# Altium project MLB_REV1.PrjPcb (part 3 of 3)

## Sheet VELOSTAT_SENSING.SchDoc: =DocumentName
size B; SheetNumber: 6; SheetTotal: 8
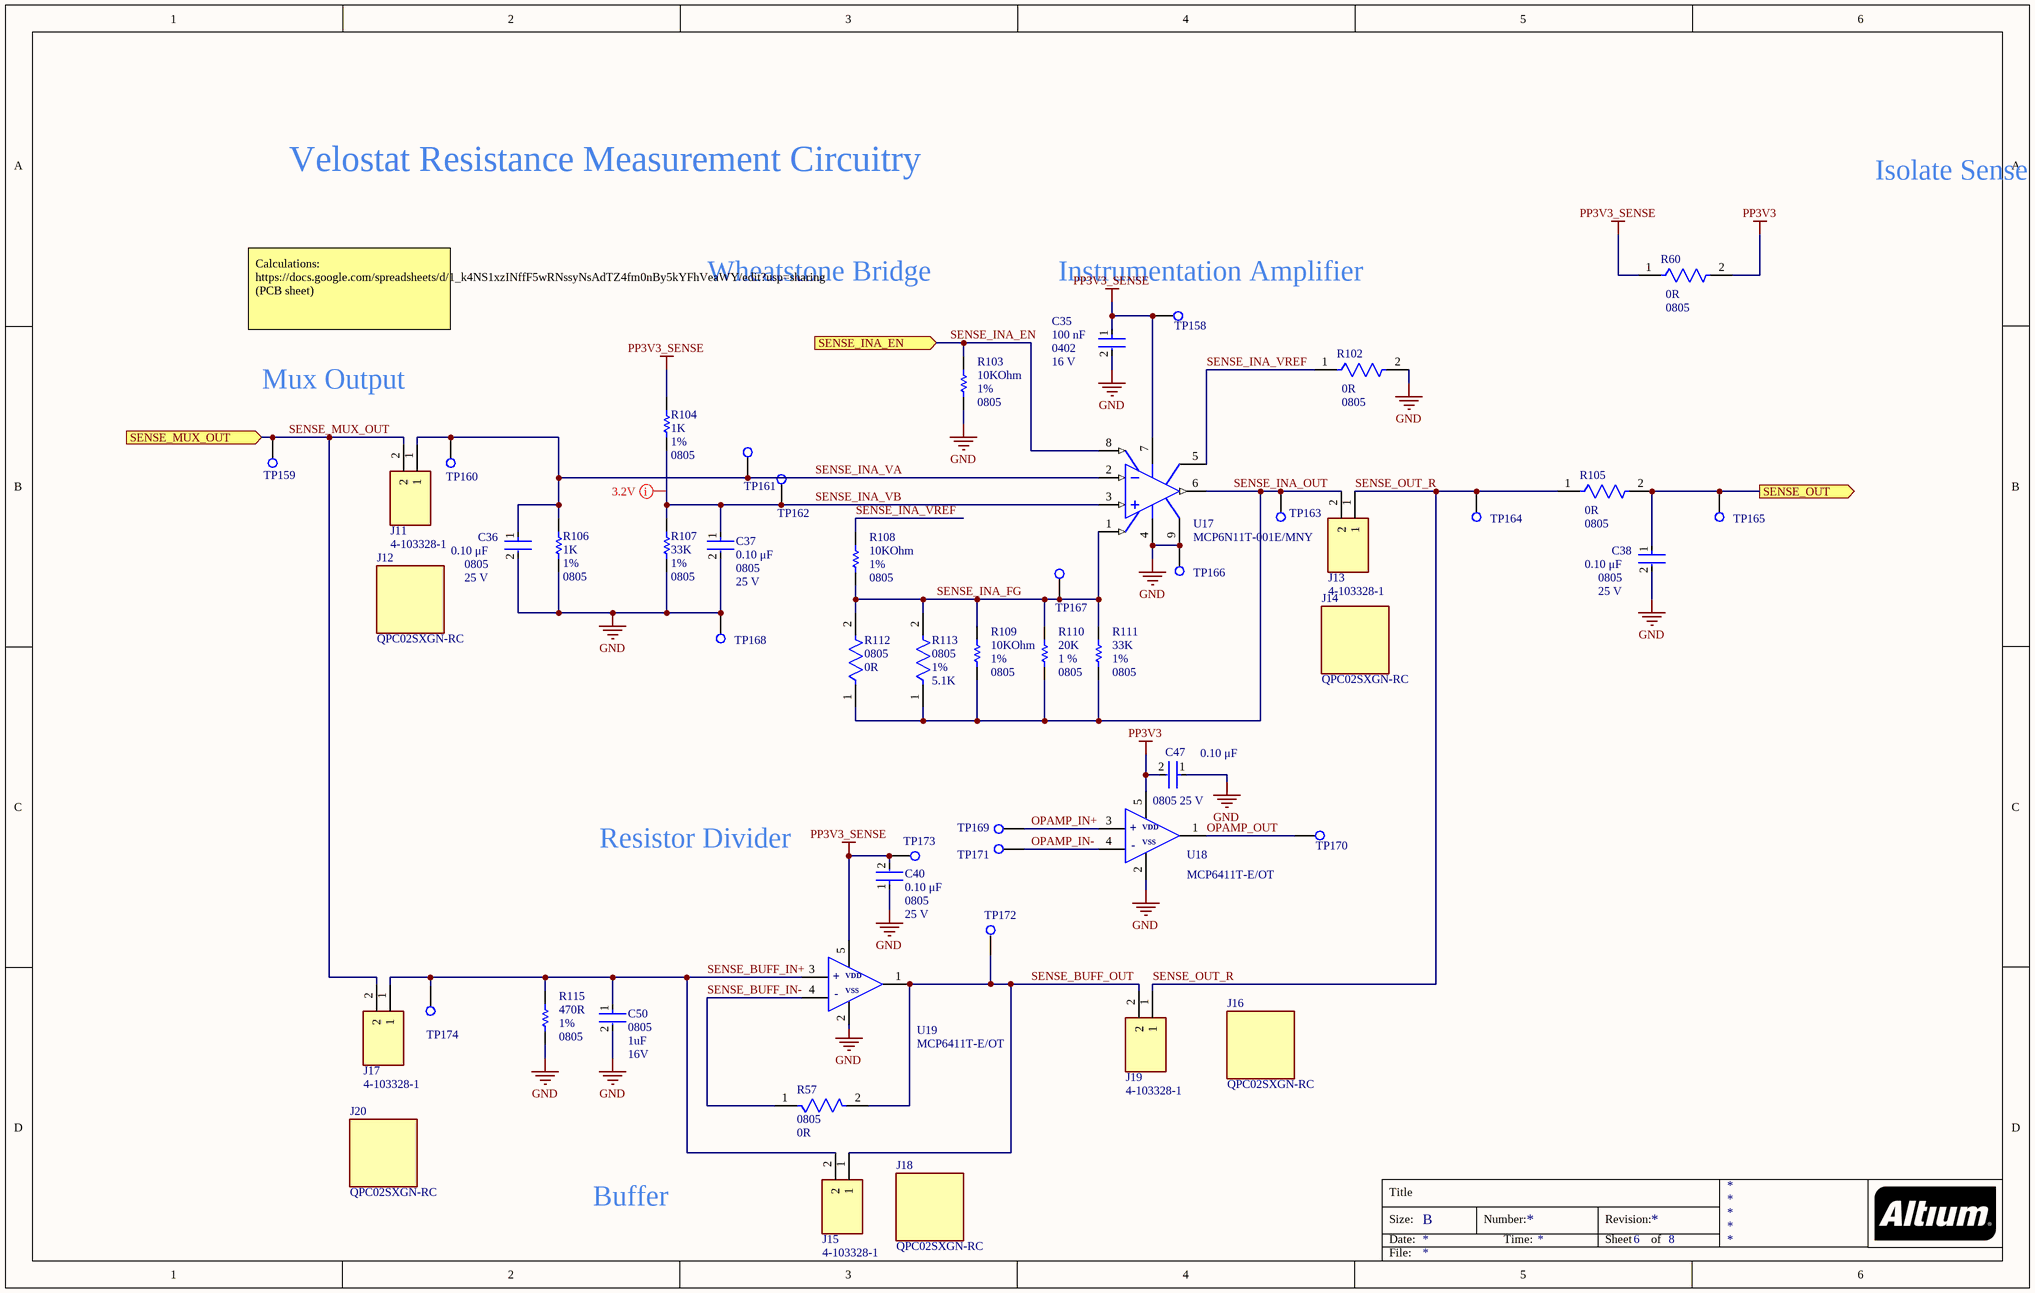
[diagram p5: VELOSTAT_SENSING.SchDoc]

### Parts
(Parts that share a designator on the sheet are numbered #1, #2 ... from top to bottom, then left to right.)
C35#2  Package: 0402  Voltage Rating: 16 V  Capacitance: 100 nF  [FP-CC0402-IPC_B]  (hidden comment: CC0402KRX7R7BB104)
C36#2  Capacitance: 0.10 μF  Package: 0805  Voltage Rating: 25 V  [FP-C0805C-DN-IPC_B]  (hidden comment: C0805C104M3RACTU)
C37#2  Capacitance: 0.10 μF  Package: 0805  Voltage Rating: 25 V  [FP-C0805C-DN-IPC_B]  (hidden comment: C0805C104M3RACTU)
C38#2  Capacitance: 0.10 μF  Package: 0805  Voltage Rating: 25 V  [FP-C0805C-DN-IPC_B]  (hidden comment: C0805C104M3RACTU)
C40  Capacitance: 0.10 μF  Package: 0805  Voltage Rating: 25 V  [FP-C0805C-DN-IPC_B]  (hidden comment: C0805C104M3RACTU)
C47#1  Capacitance: 0.10 μF  Package: 0805  Voltage Rating: 25 V  [FP-C0805C-DN-IPC_B]  (hidden comment: C0805C104M3RACTU)
C50#1  Case/Package: 0805  Capacitance: 1uF  Voltage: 16V  [FP-CL21-IPC_A]  (hidden comment: CL21B105KOFNNNE)
J11#2  4-103328-1  [TE_4-103328-1]
J12#2  QPC02SXGN-RC  [FP-QPC02SXGN-RC-MFG]
J13  4-103328-1  [TE_4-103328-1]
J14  QPC02SXGN-RC  [FP-QPC02SXGN-RC-MFG]
J15  4-103328-1  [TE_4-103328-1]
J16  QPC02SXGN-RC  [FP-QPC02SXGN-RC-MFG]
J17  4-103328-1  [TE_4-103328-1]
J18  QPC02SXGN-RC  [FP-QPC02SXGN-RC-MFG]
J19  4-103328-1  [TE_4-103328-1]
J20  QPC02SXGN-RC  [FP-QPC02SXGN-RC-MFG]
R57#2  Case/Package: 0805  Resistance: 0R  [FP-RMCF0805-MFG]  (hidden comment: RMCF0805ZT0R00)
R60#2  Case/Package: 0805  Resistance: 0R  [FP-RMCF0805-MFG]  (hidden comment: RMCF0805ZT0R00)
R102  Case/Package: 0805  Resistance: 0R  [FP-RMCF0805-MFG]  (hidden comment: RMCF0805ZT0R00)
R103  value 10KOhm  PackageReference: 0805  Tolerance: 1%  [RESC2013X60X35NL10T20]  (hidden comment: RC0805FR-0710KL)
R104  Resistance: 1K  Tolerance: 1%  Case Code (Imperial): 0805  [RESC2013X60X35ML10T20]  (hidden comment: RC0805FR-071KL)
R105  Case/Package: 0805  Resistance: 0R  [FP-RMCF0805-MFG]  (hidden comment: RMCF0805ZT0R00)
R106  Resistance: 1K  Tolerance: 1%  Case Code (Imperial): 0805  [RESC2013X60X35ML10T20]  (hidden comment: RC0805FR-071KL)
R107  value 33K  Tolerance: 1%  Package: 0805  [RESC2013X70X40LL20T20]  (hidden comment: ERJ-6GEYJ333V)
R108  value 10KOhm  PackageReference: 0805  Tolerance: 1%  [RESC2013X60X35NL10T20]  (hidden comment: RC0805FR-0710KL)
R109  value 10KOhm  PackageReference: 0805  Tolerance: 1%  [RESC2013X60X35NL10T20]  (hidden comment: RC0805FR-0710KL)
R110  value 20K  Tolerance: 1 %  Case-EIA: 0805  [RESC0805(2012)_N]  (hidden comment: 20K 1% 0805(2012))
R111  value 33K  Tolerance: 1%  Package: 0805  [RESC2013X70X40LL20T20]  (hidden comment: ERJ-6GEYJ333V)
R112  Case/Package: 0805  Resistance: 0R  [FP-RMCF0805-MFG]  (hidden comment: RMCF0805ZT0R00)
R113  Case Code (Imperial): 0805  Tolerance: 1%  Resistance: 5.1K  [FP-CRCW0805-e3-MFG]  (hidden comment: CRCW08055K10FKEA)
R115  Package Reference: 0805  Resistance Tolerance: 1%  Resistance: 470R  [RESC2013X60X35ML10T20]  (hidden comment: RC0805FR-07470RL)
TP158  RCU-0C  [TP+195X110]  (value not drawn)
TP159  RCU-0C  [TP+195X110]  (value not drawn)
TP160  RCU-0C  [TP+195X110]  (value not drawn)
TP161  RCU-0C  [TP+195X110]  (value not drawn)
TP162  RCU-0C  [TP+195X110]  (value not drawn)
TP163  RCU-0C  [TP+195X110]  (value not drawn)
TP164  RCU-0C  [TP+195X110]  (value not drawn)
TP165  RCU-0C  [TP+195X110]  (value not drawn)
TP166  RCU-0C  [TP+195X110]  (value not drawn)
TP167  RCU-0C  [TP+195X110]  (value not drawn)
TP168  RCU-0C  [TP+195X110]  (value not drawn)
TP169  RCU-0C  [TP+195X110]  (value not drawn)
TP170  RCU-0C  [TP+195X110]  (value not drawn)
TP171  RCU-0C  [TP+195X110]  (value not drawn)
TP172  RCU-0C  [TP+195X110]  (value not drawn)
TP173  RCU-0C  [TP+195X110]  (value not drawn)
TP174  RCU-0C  [TP+195X110]  (value not drawn)
U17  MCP6N11T-001E/MNY  [TDFN-MN8]
U18  MCP6411T-E/OT  [SOT95P280X145-5N]
U19  MCP6411T-E/OT  [SOT95P280X145-5N]

### Ports
SENSE_INA_EN (in), SENSE_MUX_OUT (in), SENSE_OUT (out)

### Nets
GND: C35#2.2 C36#2.2 C37#2.2 C38#2.2 C40.1 C47#1.1 C50#1.2 R102.2 R103.1 R106.1 R107.1 R115.1 TP166.1 TP168.1 U17.4(VSS) U17.9(EP) U18.2(VSS) U19.2(VSS)
PP3V3: C47#1.2 R60#2.2 U18.5(VDD)
PP3V3_SENSE: C35#2.1 C40.2 R60#2.1 R104.2 TP158.1 TP173.1 U17.7(VDD) U19.5(VDD)
OPAMP_IN+: TP169.1 U18.3(VIN+)
OPAMP_IN-: TP171.1 U18.4(VIN-)
OPAMP_OUT: TP170.1 U18.1(VOUT)
SENSE_BUFF_IN+: C50#1.1 J15.2 J17.1 R115.2 TP174.1 U19.3(VIN+)
SENSE_BUFF_IN-: R57#2.1 U19.4(VIN-)
SENSE_BUFF_OUT: J15.1 J19.2 R57#2.2 TP172.1 U19.1(VOUT)
SENSE_INA_EN: R103.2 U17.8(EN/~{CAL}) ; port SENSE_INA_EN
SENSE_INA_FG: R108.1 R109.2 R110.2 R111.2 R112.2 R113.2 TP167.1 U17.1(VFG)
SENSE_INA_OUT: J13.2 R109.1 R110.1 R111.1 R112.1 R113.1 TP163.1 U17.6(VOUT)
SENSE_INA_VA: C36#2.1 J11#2.1 R106.2 TP160.1 TP161.1 U17.2(VIM)
SENSE_INA_VB: C37#2.1 R104.1 R107.2 TP162.1 U17.3(VIP)
SENSE_INA_VREF: R102.1 R108.2 U17.5(VREF)
SENSE_MUX_OUT: J11#2.2 J17.2 TP159.1 ; port SENSE_MUX_OUT
SENSE_OUT: C38#2.1 R105.2 TP165.1 ; port SENSE_OUT
SENSE_OUT_R: J13.1 J19.1 R105.1 TP164.1

### Layout directives
mark named 3.2V: SENSE_INA_VB

### Notes on the sheet
- Velostat Resistance Measurement Circuitry
- Isolate Sense Rail from 3V3 Rail
- Wheatstone Bridge
- Instrumentation Amplifier
- Calculations: https://docs.google.com/spreadsheets/d/1_k4NS1xzINffF5wRNssyNsAdTZ4fm0nBy5kYFhVeaWY/edit?usp=sharing (PCB sheet)
- Mux Output
- Resistor Divider
- Buffer
- Title
- Size:
- Date:
- B
- Number:
- Time:
- Revision:
- Sheet
- of
- File:
- (in symbol MCP6411T-E_OT) +; -

### Library data of the parts
C35#2 = CMP-03422-000048-1: CAP CER 0.1UF 16V X7R 0402; Manufacturer: YAGEO; Material: Ceramic; Automotive Grade: NA; Temperature Coefficient: 30ppm/°C; Tolerance: 0.1; Value: 100 nF; Device Class L1: Passive Components; Temperature Range Low: -55°C; Device Class L3: Ceramic Capacitors; Temperature Characteristic: X7R; Ipc Land Pattern Name: CAPC10050X50; Temperature Range High: +125°C; Temperature: -55°C to +125°C; RoHS: TRUE; Automotive: No; Height: 0.55mm; Device Class L2: Capacitors; Digikey Description: CAP CER 0.1UF 16V X7R 0402; Footprint Url: http://www.yageo.com/exep/pages/download/literatures/UPY-C_GEN_24.pdf; ComponentLink2Description: Datasheet; Category: Cap; Lead Free: Yes; Octopart: https://octopart.com/cc0402krx7r7bb104-yageo-42244624; ComponentLink2URL: http://www.yageo.com/documents/recent/UPY-GP_NP0_16V-to-50V_16.pdf; Manufacturer Part Number: CC0402KRX7R7BB104; Mouser Description: 0402 0.1 uF 16 V ±10 % Tolerance X7R SMT Multilayer Ceramic Capacitor; Supplier: Digi-Key; Supplier Part Number: 311-1338-1-ND
C36#2 C37#2 C38#2 C40 C47#1 = CMP-2007-00282-2: CAP CER 0.1UF 25V 20% X7R 0805; Manufacturer: KEMET; Temperature Coefficient: 30ppm/°C; Material: Ceramic; Tolerance: 0.2; Value: 0.10 μF; Digikey Description: CAP CER 0.1UF 25V 20% X7R 0805; Device Class L2: Capacitors; Temperature: -55°C to +125°C; Device Class L1: Passive Components; ComponentLink2Description: Datasheet; Mouser Description: Multilayer Ceramic Capacitors MLCC - SMD/SMT 25volts 0.1uF X7R 20%; Temperature Range High: +125°C; Device Class L3: Ceramic Capacitors; Automotive: No; Temperature Range Low: -55°C; RoHS: TRUE; Category: Cap; Lead Free: Yes; Ipc Land Pattern Name: CAPC200125X78; Height: 0.88mm; Temperature Characteristic: X7R; Octopart: https://octopart.com/c0805c104m3ractu-kemet-9138612; ComponentLink2URL: https://content.kemet.com/datasheets/KEM_C1003_C0G_SMD.pdf; Manufacturer Part Number: C0805C104M3RACTU; Supplier: Digi-Key; Supplier Part Number: 399-C0805C104M3RAC7800CT-ND
C50#1 = CMP-13271-003098-1: CL21 Series 0805 1uF 16V ±10% Tolerance X7R Multilayer Ceramic Chip Capacitor; Manufacturer: Samsung Electro-Mechanics; Width: 0.049inch; Thickness: 0.053inch; Voltage Rating: 16V; Max Operating Temperature: 125°C; Case Code (Imperial): 0805; Height: 1.25mm; Length: 2mm; Lead Free: Lead Free; Mount: Surface Mount; Tolerance: 10%; Voltage Rating (DC): 16V; Min Operating Temperature: -55°C; Contact Plating: Tin; Depth: 1.25mm; Packaging: Tape and Reel; Package Quantity: 1; Dielectric: X7R; Radiation Hardening: No; Case Code (Metric): 2012; Manufacturer Part Number: CL21B105KOFNNNE; Supplier: Digi-Key; Supplier Part Number: 1276-1026-1-ND
J11#2 J13 J15 J17 J19 = 4-103328-1: Connector Header Through Hole 2 position; Manufacturer: TE Connectivity AMP Connectors; MF: TE Connectivity; SnapEDA_Link: https://www.snapeda.com/parts/4-103328-1/TE%20Connectivity%20AMP%20Connectors/view-part/2384420/?ref=snap; MP: 4-103328-1; TE_purchase_URL: https://www.te.com/usa-en/product-4-103328-1.html?te_bu=Cor&te_type=disp&te_campaign=seda_glo_cor-seda-global-disp-prtnr-fy19-seda-model-bom-cta_sma-317_1&elqCampaignId=32493; Availability: Unavailable; Value: *; EU_RoHS_Compliance: Compliant; Price: None; Package: None; Supplier: Digi-Key; Supplier Part Number: A121364-ND; Manufacturer Part Number: 4-103328-1
J12#2 J14 J16 J18 J20 = CMP-25666-000001-1: CONN JUMPER SHORTING .100" GOLD; Manufacturer: Sullins; Conn Orientation: Straight; Pitch: 2.54mm; Current Rating: 3A; Number Of Contacts: 2; Category: Conn; Temperature Range Low: -40°C; Temperature Range High: +85°C; Device Class L1: Connectors; Lead Free: Yes; Manufacturer Part Number: QPC02SXGN-RC; Automotive: No; Height: 6.17mm; ComponentLink2URL: https://s3.amazonaws.com/catalogspreads-pdf/PAGE128-129%20.100%20JUMPER.pdf; Device Class L2: unset; Footprint Url: https://drawings-pdf.s3.amazonaws.com/11510.pdf; Device Class L3: unset; Temperature: -40°C to +85°C; RoHS: TRUE; Digikey Description: CONN JUMPER SHORTING .100" GOLD; Octopart: https://octopart.com/qpc02sxgn-rc-sullins-19878795; Package: 0; ComponentLink2Description: Datasheet; Contact Material: Gold; Supplier: Digi-Key; Supplier Part Number: S9337-ND
R57#2 R60#2 R102 R105 R112 = CMP-26527-000017-1: RES 0 OHM JUMPER 1/8W 0805; Manufacturer: Stackpole Electronics Inc; Power Rating: 125mW; Depth: 1.25mm; Length: 2mm; Military Standard: Not; Width: 0.049inch; Case Code (Imperial): 0805; Number of Terminations: 2; Mount: Surface Mount; Contact Plating: Tin; Height: 0.026inch; Min Operating Temperature: -55°C; Composition: Thick Film; Max Operating Temperature: 155°C; Packaging: Tape and Reel; Features: Automotive AEC-Q200; Max Power Dissipation: 125mW; Radiation Hardening: No; Lead Free: Lead Free; Case Code (Metric): 2012; Supplier: Digi-Key; Supplier Part Number: RMCF0805ZT0R00CT-ND; Manufacturer Part Number: RMCF0805ZT0R00
R103 R108 R109 = CMP-1659-00013-4: Chip Resistor, 10 KOhm, +/- 1%, 0.125 W, -55 to 155 degC, 0805 (2012 Metric), RoHS, Tape and Reel; Manufacturer: Yageo; Voltage Rating: 150 V; Mount: Surface Mount; ComponentLink1Description: Manufacturer URL; ComponentLink2URL: http://www.yageo.com/documents/recent/PYu-RC_Group_51_RoHS_L_04.pdf; Pins: 2; Length: 2 mm; Min Operating Temperature: -55 degC; Height: 0.5 mm; Mounting Technology: Surface Mount; RoHSCompliant: true; REACH SVHC: No SVHC; ComponentLink1URL: http://www.yageo.com/; Max Operating Temperature: 155 degC; DatasheetVersion: Rev. 4, 02/2016; Package Quantity: 5000; Packaging: Tape and Reel; ComponentLink2Description: Datasheet; PackageDescription: 2-Pin Surface Mounted Device, Body 2 x 1.25 mm; Manufacturer Part Number: RC0805FR-0710KL; Supplier: Digi-Key; Supplier Part Number: RC0805FR-0710KL
R104 R106 = CMP-2100-03671-1: Chip Resistor, 1 KOhm, +/- 1%, 125 mW, -55 to 155 degC, 0805 (2012 Metric), RoHS, Tape and Reel; Manufacturer: Yageo; Temperature Coefficient: 100ppm/degreesC; Voltage Rating (DC): 150V; Max Power Dissipation: 125mW; Number of Pins: 2; Number of Terminations: 2; Datasheet URL: http://www.yageo.com/NewPortal/yageodocoutput?fileName=/pdf/R-Chip/PYu-RC_Group_51_RoHS_L_5.pdf; Length: 0.079inch; Package Description: 2-Pin Surface Mounted Device, Body 2 x 1.25 mm; Depth: 1.25mm; Height: 0.024inch; Military Standard: Not; Case/Package: 0805; Package Reference: 0805; RoHSCompliant: true; Lead Free: LeadFree; Packaging: TapeandReel; Package Quantity: 1; Datasheet Version: Rev. 5, 10/2016; Min Operating Temperature: -55degC; Voltage Rating: 150V; Composition: ThickFilm; Power Rating: 125mW; Width: 0.049inch; Case Code (Metric): 2012; Manufacturer URL: http://www.yageo.com/; Max Operating Temperature: 155degC; REACH SVHC: Unknown; Termination: SMD/SMT; Manufacturer Part Number: RC0805FR-071KL; Supplier: Digi-Key; Supplier Part Number: 311-1.00KCRCT-ND
R107 R111 = CMP-2001-00401-1: Manufacturer: Panasonic; Part Number: ERJ-6GEYJ333V; Supplier: Digi-Key; Supplier Part Number: P33KACT-ND; Manufacturer Part Number: ERJ-6GEYJ333V
R110 = CMP-1013-00655-1: 20K 0.125W 1% 0805 (2012 Metric)  SMD; Manufacturer Part Number: RC0805FR-0720KL; Manufacturer: YAGEO; Case-Metric: 2012; Power: 0.125 W; Technology: SMT; Supplier: Digi-Key; Supplier Part Number: 311-20.0KCRCT-ND
R113 = CMP-2001-04024-2: RES Thick Film, 5.1kΩ, 1%, 0.125W, 100ppm/°C, 0805; Manufacturer: Vishay Dale; Manufacturer Part Number: CRCW08055K10FKEAC; Power Rating: 125mW; Voltage Rating (DC): 150V; Packaging: Tape and Reel; Case Code (Metric): 2012; Contact Plating: Tin; Depth: 1.25mm; Width: 0.049inch; Temperature Coefficient: 100ppm/°C; Max Power Dissipation: 125mW; Military Standard: Not; Lead Free: Lead Free; Mount: Surface Mount; Min Operating Temperature: -55°C; Package Quantity: 10; Weight: 0.000194oz; Height: 0.45mm; Number of Terminations: 2; Max Operating Temperature: 155°C; Termination: SMD/SMT; Case/Package: 0805; Composition: Thick Film; Voltage Rating: 150V; Length: 2mm; Features: Automotive AEC-Q200; Radiation Hardening: No; Supplier: Digi-Key; Supplier Part Number: 541-CRCW08055K10FKEACCT-ND
R115 = CMP-2000-06961-1: Chip Resistor, 470 Ohm, +/- 1%, 125 mW, -55 to 155 degC, 0805 (2012 Metric), RoHS, Tape and Reel; Manufacturer: Yageo; Power Rating: 250mW; Resistor Case Style: 0805[2012Metric]; Voltage Rating: 150V; Resistor Element Type: ThickFilm; Temperature Coefficient: ±100ppm/°C; SVHC: ToBeAdvised; Datasheet Version: Rev. 7, 05/2017; Automotive Qualification Standard: -; Mounting Technology: SurfaceMount; Product Range: -; Packaging: Tape&Reel; Package Description: 2-Pin Surface Mounted Device, Body 2 x 1.25 mm; MSL: MSL1-Unlimited; Datasheet URL: http://www.yageo.com/documents/recent/PYu-RC_Group_51_RoHS_L_7.pdf; Manufacturer URL: http://www.yageo.com/; Supplier: Digi-Key; Supplier Part Number: 311-470CRCT-ND; Manufacturer Part Number: RC0805FR-07470RL
TP158-TP174 = RCU-0C: Natural PC Test Point , Plating Surface Mount Mounting Type; Manufacturer: TE Connectivity AMP Connectors; Value: *; Package: SON-6 TE Connectivity AMP Connectors; Purchase-URL: https://pricing.snapeda.com/search/part/RCU-0C/?ref=eda; Supplier Part Number: A106145CT-ND; Check_prices: https://www.snapeda.com/parts/RCU-0C/TE%20Connectivity/view-part/4791537/?ref=eda; Manufacturer Part Number: RCU-0C; SnapEDA_Link: https://www.snapeda.com/parts/RCU-0C/TE%20Connectivity/view-part/4791537/?ref=snap; Supplier: Digi-Key
U17 = CMP-0187-00751-2: None; Manufacturer: Microchip Technology; Supply Current: 800uA; Max Supply Voltage: 5.5V; Number of Circuits: 1; Input Offset Voltage (Vos): 3mV; Number of Elements: 2; Power Supply Rejection Ratio (PSRR): 62dB; Common Mode Rejection Ratio: 70dB; Unity Gain Bandwidth Product: 500kHz; Slew Rate: 9V/µs; Min Supply Voltage: 1.8V; Input Bias Current: 10pA; Height: 0.75mm; Number of Pins: 8; Min Operating Temperature: -40°C; Lead Free: Lead Free; Number of Channels: 1; REACH SVHC: No SVHC; Max Supply Current: 800uA; Gain Bandwidth Product: 500kHz; Bandwidth: 500kHz; RoHS Compliant: Yes; Length: 3mm; Number of Amplifiers: 1; Package Quantity: 3300; Width: 2mm; Mount: Surface Mount; Radiation Hardening: No; Case/Package: SOIC; Input Offset Voltage-Max: 3mV; Max Operating Temperature: 125°C; Packaging: Tape and Reel; Nominal Supply Current: 800uA; Supplier: Digi-Key; Supplier Part Number: MCP6N11T-001E/MNYCT-ND; Manufacturer Part Number: MCP6N11T-001E/MNY
U18 U19 = MCP6411T-E_OT: IC OPAMP GP 1 CIRCUIT SOT23-5; Manufacturer: Microchip; Datasheet Link: http://ww1.microchip.com/downloads/en/DeviceDoc/20005791B.pdf; Height: 1.45mm; Manufacturer Part Number: MCP6411T-E/OT; Mouser Part Number: 579-MCP6411T-E/OT; Mouser Price/Stock: https://www.mouser.com/Search/Refine.aspx?Keyword=579-MCP6411T-E%2FOT; Arrow Part Number: MCP6411T-E/OT; Arrow Price/Stock: https://www.arrow.com/en/products/mcp6411t-eot/microchip-technology; Supplier: Digi-Key; Supplier Part Number: MCP6411T-E/OTCT-ND

## Sheet MAT_CABLING_CONNECTOR.SchDoc: =DocumentName
size B; SheetNumber: 7; SheetTotal: 8
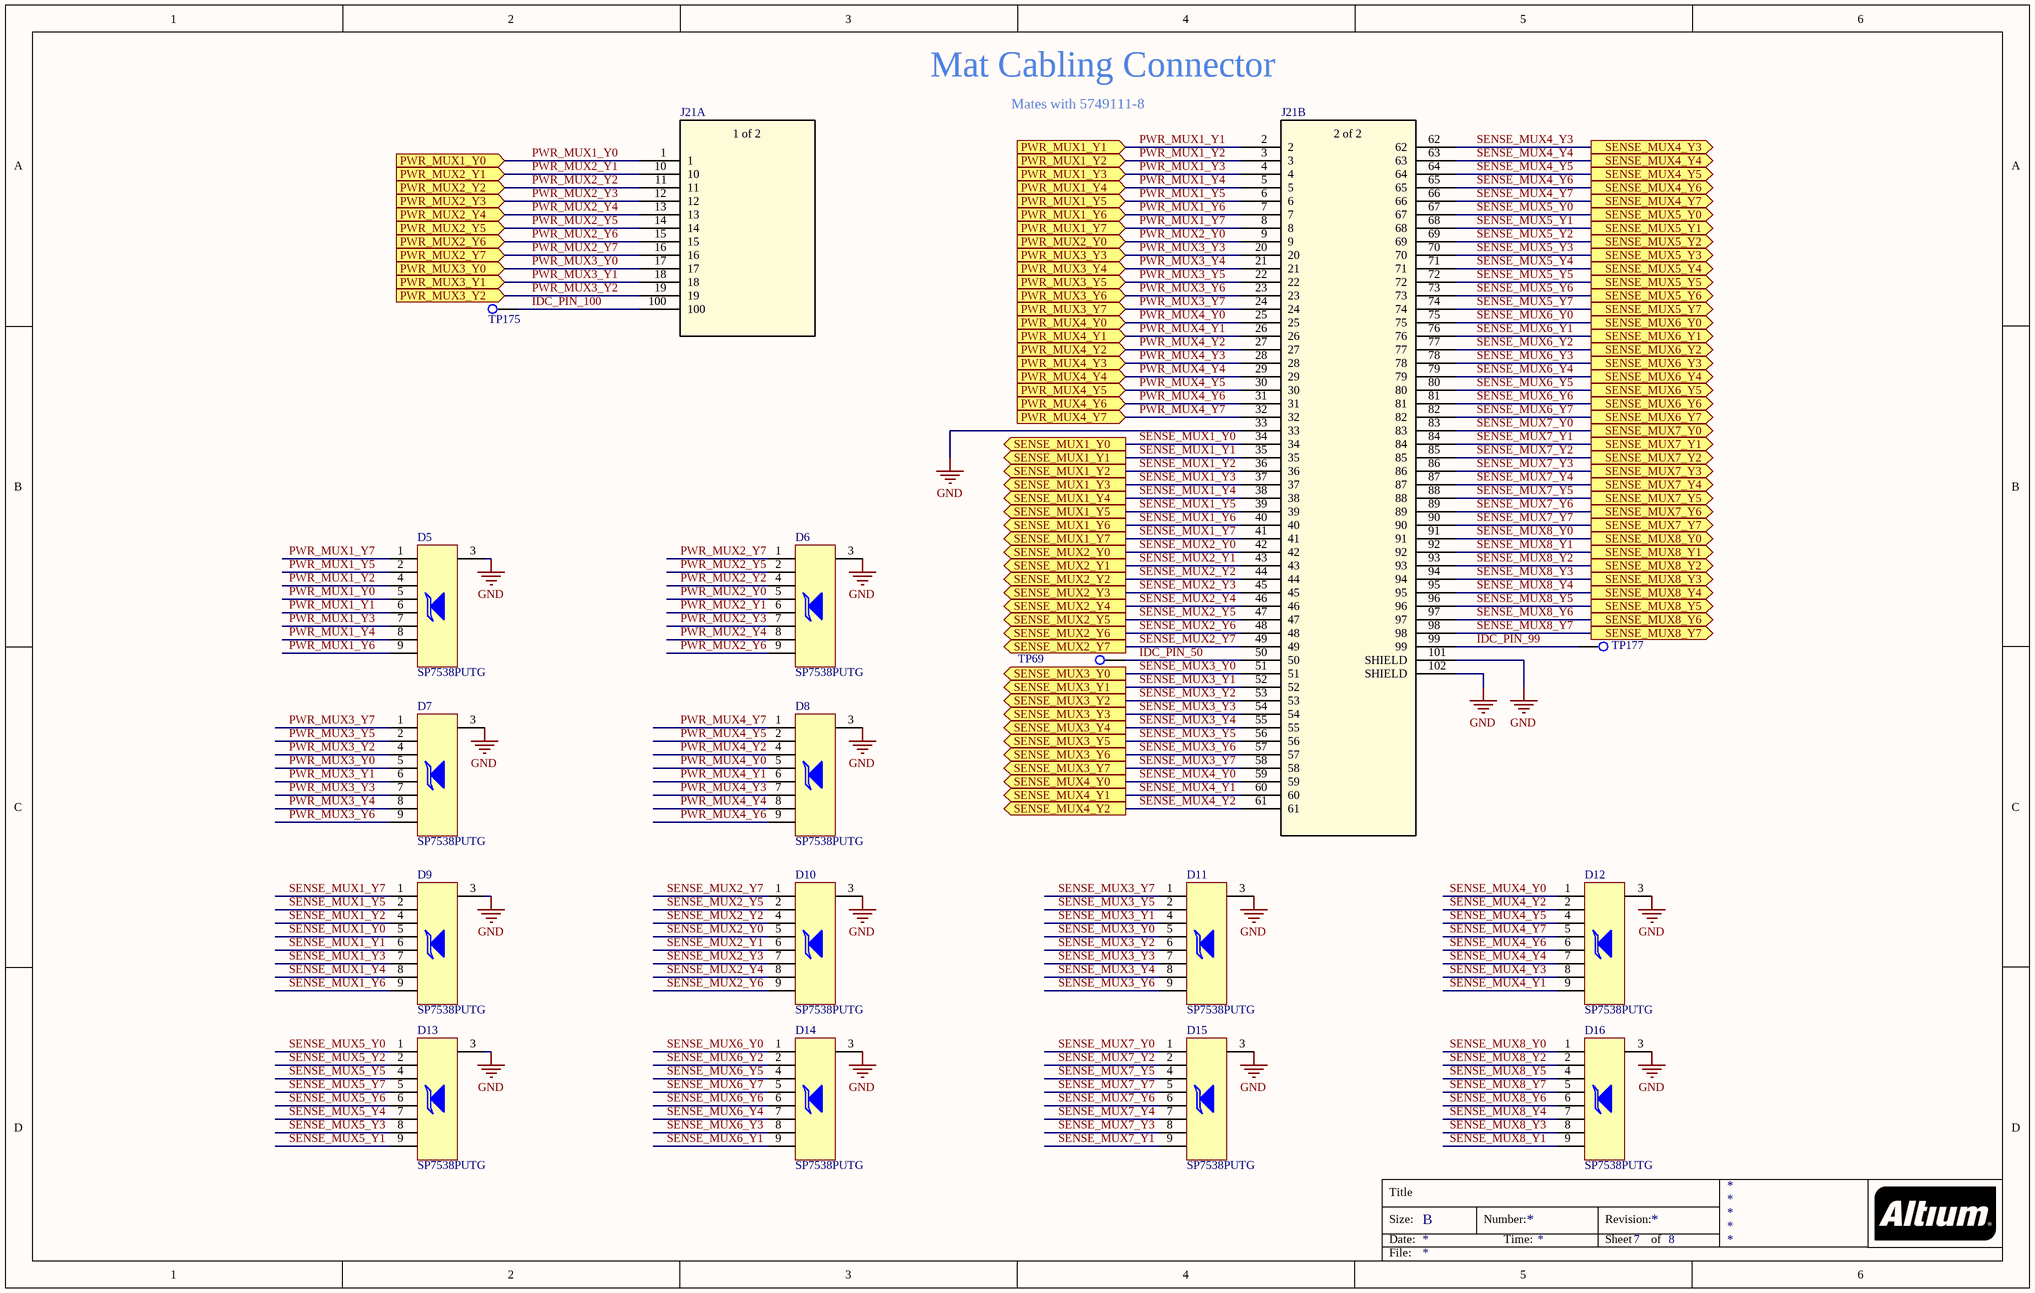
[diagram p6: MAT_CABLING_CONNECTOR.SchDoc]

### Parts
D5  SP7538PUTG  [SP7538PUTG]
D6  SP7538PUTG  [SP7538PUTG]
D7  SP7538PUTG  [SP7538PUTG]
D8  SP7538PUTG  [SP7538PUTG]
D9  SP7538PUTG  [SP7538PUTG]
D10  SP7538PUTG  [SP7538PUTG]
D11  SP7538PUTG  [SP7538PUTG]
D12  SP7538PUTG  [SP7538PUTG]
D13  SP7538PUTG  [SP7538PUTG]
D14  SP7538PUTG  [SP7538PUTG]
D15  SP7538PUTG  [SP7538PUTG]
D16  SP7538PUTG  [SP7538PUTG]
J21  1-787082-8  [CONN100_1-787082-8_TEC]  (value not drawn)  (parts A,B of 2)
TP69  RCU-0C  [TP+195X110]  (value not drawn)
TP175  RCU-0C  [TP+195X110]  (value not drawn)
TP177  RCU-0C  [TP+195X110]  (value not drawn)

### Ports
PWR_MUX1_Y0 (in), PWR_MUX1_Y1 (in), PWR_MUX1_Y2 (in), PWR_MUX1_Y3 (in), PWR_MUX1_Y4 (in), PWR_MUX1_Y5 (in), PWR_MUX1_Y6 (in), PWR_MUX1_Y7 (in), PWR_MUX2_Y0 (in), PWR_MUX2_Y1 (in), PWR_MUX2_Y2 (in), PWR_MUX2_Y3 (in), PWR_MUX2_Y4 (in), PWR_MUX2_Y5 (in), PWR_MUX2_Y6 (in), PWR_MUX2_Y7 (in), PWR_MUX3_Y0 (in), PWR_MUX3_Y1 (in), PWR_MUX3_Y2 (in), PWR_MUX3_Y3 (in), PWR_MUX3_Y4 (in), PWR_MUX3_Y5 (in), PWR_MUX3_Y6 (in), PWR_MUX3_Y7 (in), PWR_MUX4_Y0 (in), PWR_MUX4_Y1 (in), PWR_MUX4_Y2 (in), PWR_MUX4_Y3 (in), PWR_MUX4_Y4 (in), PWR_MUX4_Y5 (in), PWR_MUX4_Y6 (in), PWR_MUX4_Y7 (in), SENSE_MUX1_Y0 (out), SENSE_MUX1_Y1 (out), SENSE_MUX1_Y2 (out), SENSE_MUX1_Y3 (out), SENSE_MUX1_Y4 (out), SENSE_MUX1_Y5 (out), SENSE_MUX1_Y6 (out), SENSE_MUX1_Y7 (out), SENSE_MUX2_Y0 (out), SENSE_MUX2_Y1 (out), SENSE_MUX2_Y2 (out), SENSE_MUX2_Y3 (out), SENSE_MUX2_Y4 (out), SENSE_MUX2_Y5 (out), SENSE_MUX2_Y6 (out), SENSE_MUX2_Y7 (out), SENSE_MUX3_Y0 (out), SENSE_MUX3_Y1 (out), SENSE_MUX3_Y2 (out), SENSE_MUX3_Y3 (out), SENSE_MUX3_Y4 (out), SENSE_MUX3_Y5 (out), SENSE_MUX3_Y6 (out), SENSE_MUX3_Y7 (out), SENSE_MUX4_Y0 (out), SENSE_MUX4_Y1 (out), SENSE_MUX4_Y2 (out), SENSE_MUX4_Y3 (out), SENSE_MUX4_Y4 (out), SENSE_MUX4_Y5 (out), SENSE_MUX4_Y6 (out), SENSE_MUX4_Y7 (out), SENSE_MUX5_Y0 (out), SENSE_MUX5_Y1 (out), SENSE_MUX5_Y2 (out), SENSE_MUX5_Y3 (out), SENSE_MUX5_Y4 (out), SENSE_MUX5_Y5 (out), SENSE_MUX5_Y6 (out), SENSE_MUX5_Y7 (out), SENSE_MUX6_Y0 (out), SENSE_MUX6_Y1 (out), SENSE_MUX6_Y2 (out), SENSE_MUX6_Y3 (out), SENSE_MUX6_Y4 (out), SENSE_MUX6_Y5 (out), SENSE_MUX6_Y6 (out), SENSE_MUX6_Y7 (out), SENSE_MUX7_Y0 (out), SENSE_MUX7_Y1 (out), SENSE_MUX7_Y2 (out), SENSE_MUX7_Y3 (out), SENSE_MUX7_Y4 (out), SENSE_MUX7_Y5 (out), SENSE_MUX7_Y6 (out), SENSE_MUX7_Y7 (out), SENSE_MUX8_Y0 (out), SENSE_MUX8_Y1 (out), SENSE_MUX8_Y2 (out), SENSE_MUX8_Y3 (out), SENSE_MUX8_Y4 (out), SENSE_MUX8_Y5 (out), SENSE_MUX8_Y6 (out), SENSE_MUX8_Y7 (out)

### Nets
GND: D5.3 D6.3 D7.3 D8.3 D9.3 D10.3 D11.3 D12.3 D13.3 D14.3 D15.3 D16.3 J21.33 J21.101(SHIELD) J21.102(SHIELD)
IDC_PIN_50: J21.50 TP69.1
IDC_PIN_99: J21.99 TP177.1
IDC_PIN_100: J21.100 TP175.1
PWR_MUX1_Y0: D5.5 J21.1 ; port PWR_MUX1_Y0
PWR_MUX1_Y1: D5.6 J21.2 ; port PWR_MUX1_Y1
PWR_MUX1_Y2: D5.4 J21.3 ; port PWR_MUX1_Y2
PWR_MUX1_Y3: D5.7 J21.4 ; port PWR_MUX1_Y3
PWR_MUX1_Y4: D5.8 J21.5 ; port PWR_MUX1_Y4
PWR_MUX1_Y5: D5.2 J21.6 ; port PWR_MUX1_Y5
PWR_MUX1_Y6: D5.9 J21.7 ; port PWR_MUX1_Y6
PWR_MUX1_Y7: D5.1 J21.8 ; port PWR_MUX1_Y7
PWR_MUX2_Y0: D6.5 J21.9 ; port PWR_MUX2_Y0
PWR_MUX2_Y1: D6.6 J21.10 ; port PWR_MUX2_Y1
PWR_MUX2_Y2: D6.4 J21.11 ; port PWR_MUX2_Y2
PWR_MUX2_Y3: D6.7 J21.12 ; port PWR_MUX2_Y3
PWR_MUX2_Y4: D6.8 J21.13 ; port PWR_MUX2_Y4
PWR_MUX2_Y5: D6.2 J21.14 ; port PWR_MUX2_Y5
PWR_MUX2_Y6: D6.9 J21.15 ; port PWR_MUX2_Y6
PWR_MUX2_Y7: D6.1 J21.16 ; port PWR_MUX2_Y7
PWR_MUX3_Y0: D7.5 J21.17 ; port PWR_MUX3_Y0
PWR_MUX3_Y1: D7.6 J21.18 ; port PWR_MUX3_Y1
PWR_MUX3_Y2: D7.4 J21.19 ; port PWR_MUX3_Y2
PWR_MUX3_Y3: D7.7 J21.20 ; port PWR_MUX3_Y3
PWR_MUX3_Y4: D7.8 J21.21 ; port PWR_MUX3_Y4
PWR_MUX3_Y5: D7.2 J21.22 ; port PWR_MUX3_Y5
PWR_MUX3_Y6: D7.9 J21.23 ; port PWR_MUX3_Y6
PWR_MUX3_Y7: D7.1 J21.24 ; port PWR_MUX3_Y7
PWR_MUX4_Y0: D8.5 J21.25 ; port PWR_MUX4_Y0
PWR_MUX4_Y1: D8.6 J21.26 ; port PWR_MUX4_Y1
PWR_MUX4_Y2: D8.4 J21.27 ; port PWR_MUX4_Y2
PWR_MUX4_Y3: D8.7 J21.28 ; port PWR_MUX4_Y3
PWR_MUX4_Y4: D8.8 J21.29 ; port PWR_MUX4_Y4
PWR_MUX4_Y5: D8.2 J21.30 ; port PWR_MUX4_Y5
PWR_MUX4_Y6: D8.9 J21.31 ; port PWR_MUX4_Y6
PWR_MUX4_Y7: D8.1 J21.32 ; port PWR_MUX4_Y7
SENSE_MUX1_Y0: D9.5 J21.34 ; port SENSE_MUX1_Y0
SENSE_MUX1_Y1: D9.6 J21.35 ; port SENSE_MUX1_Y1
SENSE_MUX1_Y2: D9.4 J21.36 ; port SENSE_MUX1_Y2
SENSE_MUX1_Y3: D9.7 J21.37 ; port SENSE_MUX1_Y3
SENSE_MUX1_Y4: D9.8 J21.38 ; port SENSE_MUX1_Y4
SENSE_MUX1_Y5: D9.2 J21.39 ; port SENSE_MUX1_Y5
SENSE_MUX1_Y6: D9.9 J21.40 ; port SENSE_MUX1_Y6
SENSE_MUX1_Y7: D9.1 J21.41 ; port SENSE_MUX1_Y7
SENSE_MUX2_Y0: D10.5 J21.42 ; port SENSE_MUX2_Y0
SENSE_MUX2_Y1: D10.6 J21.43 ; port SENSE_MUX2_Y1
SENSE_MUX2_Y2: D10.4 J21.44 ; port SENSE_MUX2_Y2
SENSE_MUX2_Y3: D10.7 J21.45 ; port SENSE_MUX2_Y3
SENSE_MUX2_Y4: D10.8 J21.46 ; port SENSE_MUX2_Y4
SENSE_MUX2_Y5: D10.2 J21.47 ; port SENSE_MUX2_Y5
SENSE_MUX2_Y6: D10.9 J21.48 ; port SENSE_MUX2_Y6
SENSE_MUX2_Y7: D10.1 J21.49 ; port SENSE_MUX2_Y7
SENSE_MUX3_Y0: D11.5 J21.51 ; port SENSE_MUX3_Y0
SENSE_MUX3_Y1: D11.4 J21.52 ; port SENSE_MUX3_Y1
SENSE_MUX3_Y2: D11.6 J21.53 ; port SENSE_MUX3_Y2
SENSE_MUX3_Y3: D11.7 J21.54 ; port SENSE_MUX3_Y3
SENSE_MUX3_Y4: D11.8 J21.55 ; port SENSE_MUX3_Y4
SENSE_MUX3_Y5: D11.2 J21.56 ; port SENSE_MUX3_Y5
SENSE_MUX3_Y6: D11.9 J21.57 ; port SENSE_MUX3_Y6
SENSE_MUX3_Y7: D11.1 J21.58 ; port SENSE_MUX3_Y7
SENSE_MUX4_Y0: D12.1 J21.59 ; port SENSE_MUX4_Y0
SENSE_MUX4_Y1: D12.9 J21.60 ; port SENSE_MUX4_Y1
SENSE_MUX4_Y2: D12.2 J21.61 ; port SENSE_MUX4_Y2
SENSE_MUX4_Y3: D12.8 J21.62 ; port SENSE_MUX4_Y3
SENSE_MUX4_Y4: D12.7 J21.63 ; port SENSE_MUX4_Y4
SENSE_MUX4_Y5: D12.4 J21.64 ; port SENSE_MUX4_Y5
SENSE_MUX4_Y6: D12.6 J21.65 ; port SENSE_MUX4_Y6
SENSE_MUX4_Y7: D12.5 J21.66 ; port SENSE_MUX4_Y7
SENSE_MUX5_Y0: D13.1 J21.67 ; port SENSE_MUX5_Y0
SENSE_MUX5_Y1: D13.9 J21.68 ; port SENSE_MUX5_Y1
SENSE_MUX5_Y2: D13.2 J21.69 ; port SENSE_MUX5_Y2
SENSE_MUX5_Y3: D13.8 J21.70 ; port SENSE_MUX5_Y3
SENSE_MUX5_Y4: D13.7 J21.71 ; port SENSE_MUX5_Y4
SENSE_MUX5_Y5: D13.4 J21.72 ; port SENSE_MUX5_Y5
SENSE_MUX5_Y6: D13.6 J21.73 ; port SENSE_MUX5_Y6
SENSE_MUX5_Y7: D13.5 J21.74 ; port SENSE_MUX5_Y7
SENSE_MUX6_Y0: D14.1 J21.75 ; port SENSE_MUX6_Y0
SENSE_MUX6_Y1: D14.9 J21.76 ; port SENSE_MUX6_Y1
SENSE_MUX6_Y2: D14.2 J21.77 ; port SENSE_MUX6_Y2
SENSE_MUX6_Y3: D14.8 J21.78 ; port SENSE_MUX6_Y3
SENSE_MUX6_Y4: D14.7 J21.79 ; port SENSE_MUX6_Y4
SENSE_MUX6_Y5: D14.4 J21.80 ; port SENSE_MUX6_Y5
SENSE_MUX6_Y6: D14.6 J21.81 ; port SENSE_MUX6_Y6
SENSE_MUX6_Y7: D14.5 J21.82 ; port SENSE_MUX6_Y7
SENSE_MUX7_Y0: D15.1 J21.83 ; port SENSE_MUX7_Y0
SENSE_MUX7_Y1: D15.9 J21.84 ; port SENSE_MUX7_Y1
SENSE_MUX7_Y2: D15.2 J21.85 ; port SENSE_MUX7_Y2
SENSE_MUX7_Y3: D15.8 J21.86 ; port SENSE_MUX7_Y3
SENSE_MUX7_Y4: D15.7 J21.87 ; port SENSE_MUX7_Y4
SENSE_MUX7_Y5: D15.4 J21.88 ; port SENSE_MUX7_Y5
SENSE_MUX7_Y6: D15.6 J21.89 ; port SENSE_MUX7_Y6
SENSE_MUX7_Y7: D15.5 J21.90 ; port SENSE_MUX7_Y7
SENSE_MUX8_Y0: D16.1 J21.91 ; port SENSE_MUX8_Y0
SENSE_MUX8_Y1: D16.9 J21.92 ; port SENSE_MUX8_Y1
SENSE_MUX8_Y2: D16.2 J21.93 ; port SENSE_MUX8_Y2
SENSE_MUX8_Y3: D16.8 J21.94 ; port SENSE_MUX8_Y3
SENSE_MUX8_Y4: D16.7 J21.95 ; port SENSE_MUX8_Y4
SENSE_MUX8_Y5: D16.4 J21.96 ; port SENSE_MUX8_Y5
SENSE_MUX8_Y6: D16.6 J21.97 ; port SENSE_MUX8_Y6
SENSE_MUX8_Y7: D16.5 J21.98 ; port SENSE_MUX8_Y7

### Notes on the sheet
- Mat Cabling Connector
- Mates with 5749111-8
- Title
- Size:
- Date:
- B
- Number:
- Time:
- Revision:
- Sheet
- of
- File:
- (in symbol 1-787082-8, part A) 1 of 2
- (in symbol 1-787082-8, part B) 2 of 2

### Library data of the parts
D5-D16 = SP7538PUTG: ESD Suppressor TVS Octal Uni-Dir 25kV 9-Pin UDFN T/R; Manufacturer: Littelfuse; Number of Unidirectional Channels: 8; Reverse Standoff Voltage: 5V; Clamping Voltage: 7V; Peak Pulse Current: 2A; Power Line Protection: Yes; Supplier: Digi-Key; RoHS: Yes; Category: TVS Diodes; Stock 1: 40273; Pricing 1: 1=0.95000, 10=0.85200, 100=0.66410, 500=0.54862, 1000=0.43838 (USD); Mount: Surface Mount; Number of Pins: 9; Min Operating Temperature: -40°C; Max Operating Temperature: 150°C; Packaging: Cut Tape; RoHS Compliant: Yes; ComponentLink1URL: http://www.littelfuse.com/~/media/electronics/datasheets/tvs_diode_arrays/littelfuse_tvs_diode_array_sp7538p_datasheet.pdf.pdf?src-supplier=Farnell; ComponentLink1Description: http://www.littelfuse.com/~/media/electronics/datasheets/tvs_diode_arrays/littelfuse_tvs_diode_array_sp7538p_datasheet.pdf.pdf?src-supplier=Farnell; ComponentLink2URL: http://www.littelfuse.com/~/media/electronics/datasheets/tvs_diode_arrays/littelfuse_tvs_diode_array_sp7538p_datasheet.pdf.pdf?src-supplier=Digi-Key; ComponentLink2Description: http://www.littelfuse.com/~/media/electronics/datasheets/tvs_diode_arrays/littelfuse_tvs_diode_array_sp7538p_datasheet.pdf.pdf?src-supplier=Digi-Key; ComponentLink3URL: https://www.littelfuse.com/~/media/electronics/datasheets/tvs_diode_arrays/littelfuse_tvs_diode_array_sp7538p_datasheet.pdf.pdf?src-supplier=Digi-Key; ComponentLink3Description: https://www.littelfuse.com/~/media/electronics/datasheets/tvs_diode_arrays/littelfuse_tvs_diode_array_sp7538p_datasheet.pdf.pdf?src-supplier=Digi-Key; ComponentLink4URL: http://www.littelfuse.com/~/media/electronics/datasheets/tvs_diode_arrays/littelfuse_tvs_diode_array_sp7538p_datasheet.pdf.pdf?src-supplier=Arrow+Electronics; ComponentLink4Description: http://www.littelfuse.com/~/media/electronics/datasheets/tvs_diode_arrays/littelfuse_tvs_diode_array_sp7538p_datasheet.pdf.pdf?src-supplier=Arrow+Electronics; ComponentLink5URL: http://www.littelfuse.com/~/media/electronics/datasheets/tvs_diode_arrays/littelfuse_tvs_diode_array_sp7538p_datasheet.pdf.pdf?src-supplier=Mouser; ComponentLink5Description: http://www.littelfuse.com/~/media/electronics/datasheets/tvs_diode_arrays/littelfuse_tvs_diode_array_sp7538p_datasheet.pdf.pdf?src-supplier=Mouser; ComponentLink6URL: http://www.littelfuse.com/~/media/electronics/datasheets/tvs_diode_arrays/littelfuse_tvs_diode_array_sp7538p_datasheet.pdf.pdf?src-supplier=Verical; ComponentLink6Description: http://www.littelfuse.com/~/media/electronics/datasheets/tvs_diode_arrays/littelfuse_tvs_diode_array_sp7538p_datasheet.pdf.pdf?src-supplier=Verical; ComponentLink7URL: http://www.littelfuse.com/~/media/electronics/datasheets/tvs_diode_arrays/littelfuse_tvs_diode_array_sp7538p_datasheet.pdf.pdf?src-supplier=Newark; ComponentLink7Description: http://www.littelfuse.com/~/media/electronics/datasheets/tvs_diode_arrays/littelfuse_tvs_diode_array_sp7538p_datasheet.pdf.pdf?src-supplier=Newark; ComponentLink8URL: http://www.littelfuse.com/~/media/electronics/datasheets/tvs_diode_arrays/littelfuse_tvs_diode_array_sp7538p_datasheet.pdf.pdf?src-supplier=TTI; ComponentLink8Description: http://www.littelfuse.com/~/media/electronics/datasheets/tvs_diode_arrays/littelfuse_tvs_diode_array_sp7538p_datasheet.pdf.pdf?src-supplier=TTI; Supplier Part Number: F7417CT-ND; Manufacturer Part Number: SP7538PUTG
J21 = 1-787082-8: No Description Available; Mfr_Name: TE Connectivity; Copyright: Copyright (C) 2022 Ultra Librarian. All rights reserved.; Manufacturer_Part_Number: 1-787082-8; Digi-Key_Part_Number_1: A35091-ND; RefDes: RefDes; Type: DEV
TP69 TP175 TP177 = RCU-0C: as TP158-TP174 on sheet VELOSTAT_SENSING; Value: *; Package: SON-6 TE Connectivity AMP Connectors; Purchase-URL: https://pricing.snapeda.com/search/part/RCU-0C/?ref=eda; Supplier Part Number: A106145CT-ND; Check_prices: https://www.snapeda.com/parts/RCU-0C/TE%20Connectivity/view-part/4791537/?ref=eda; Manufacturer Part Number: RCU-0C; SnapEDA_Link: https://www.snapeda.com/parts/RCU-0C/TE%20Connectivity/view-part/4791537/?ref=snap; Supplier: Digi-Key

## Sheet MICROPHONE.SchDoc: =DocumentName
size B; SheetNumber: 8; SheetTotal: 8
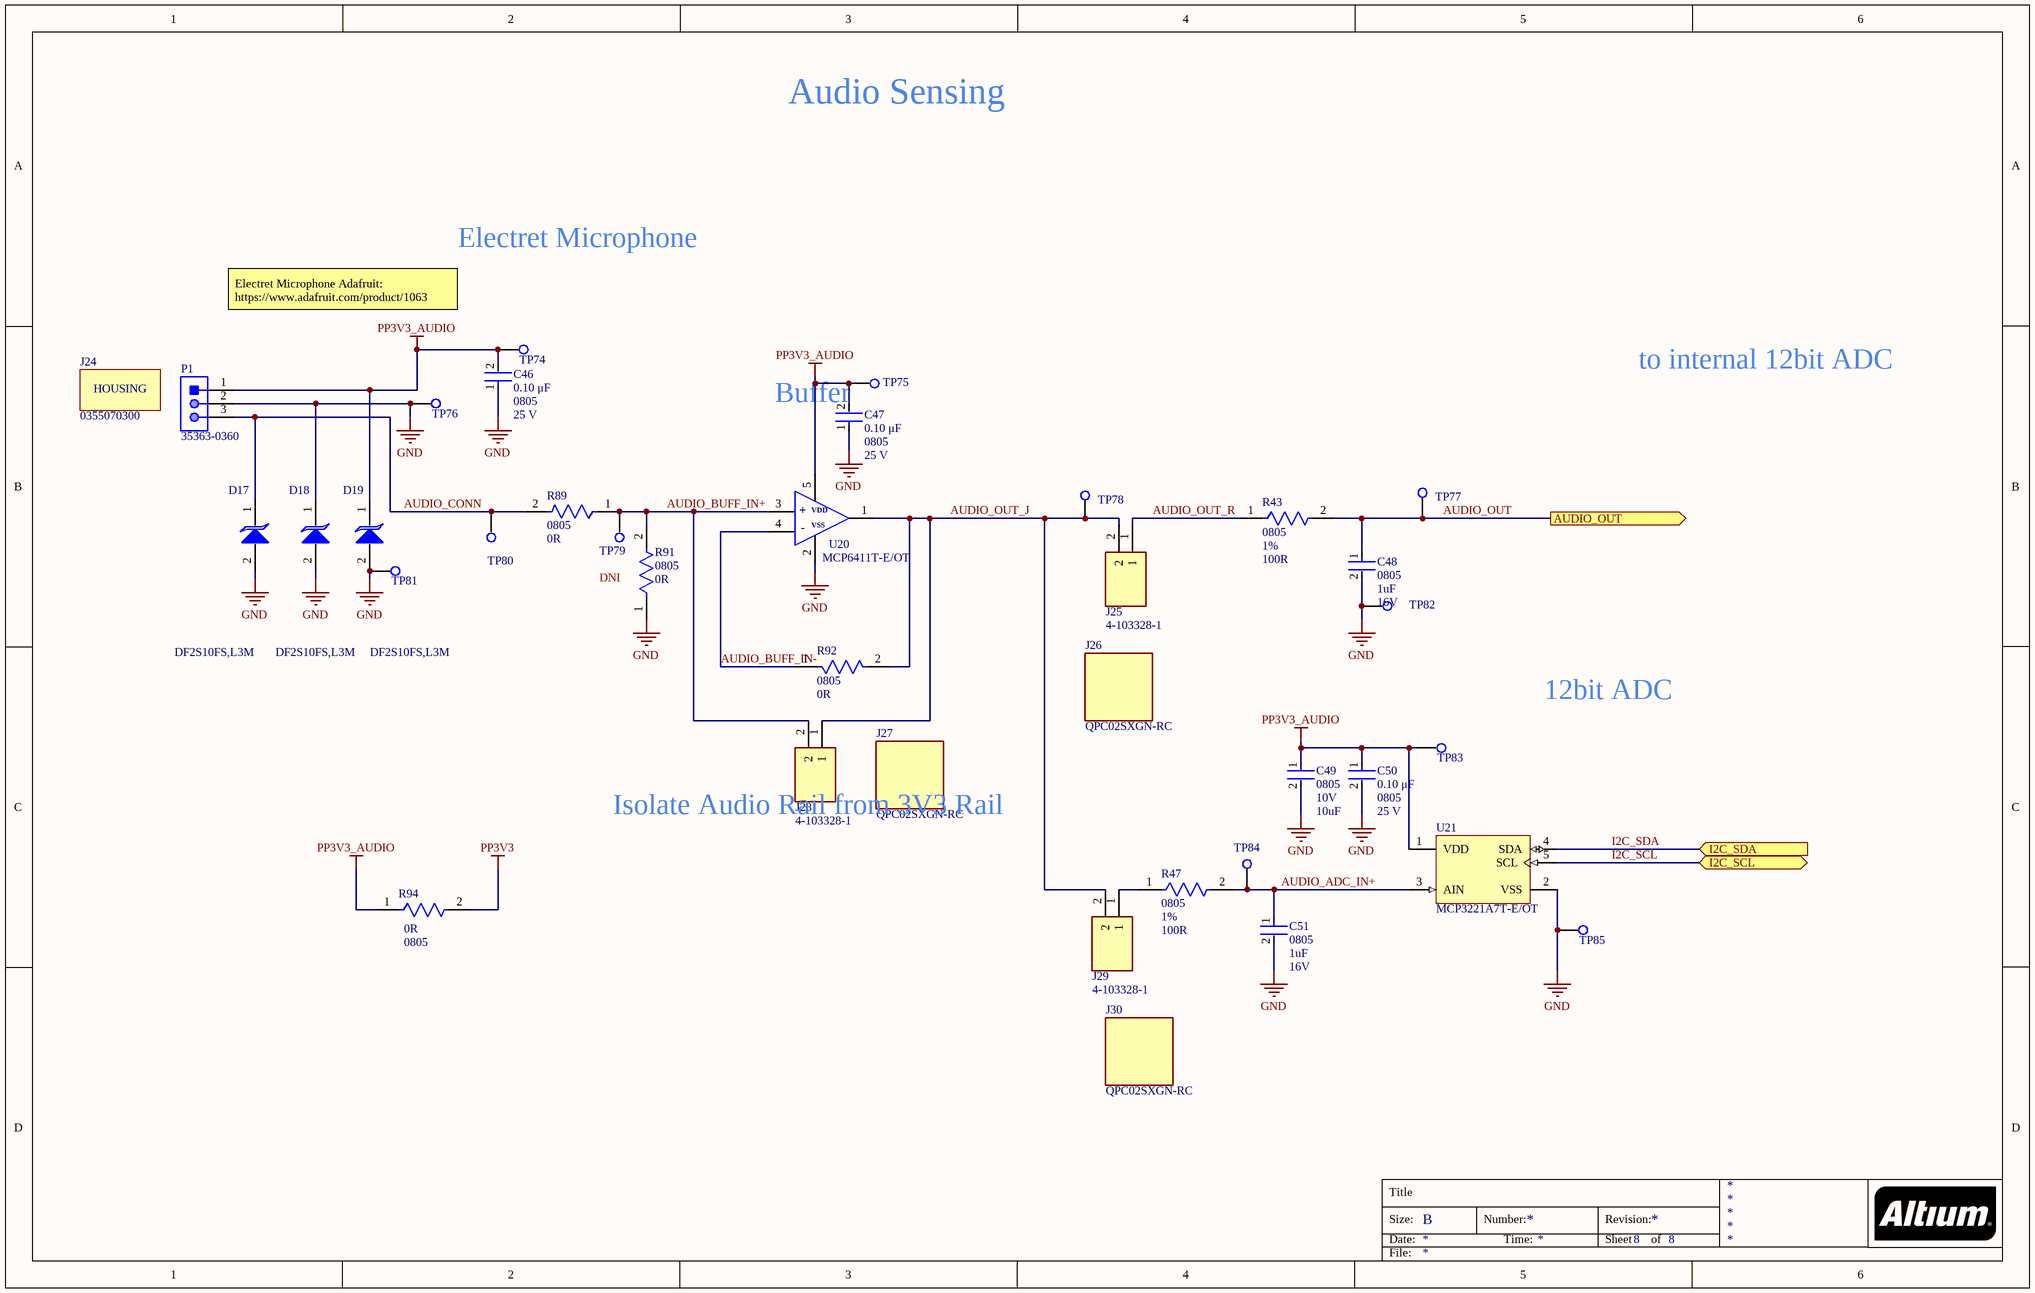
[diagram p7: MICROPHONE.SchDoc]

### Parts
(Parts that share a designator on the sheet are numbered #1, #2 ... from top to bottom, then left to right.)
C46  Capacitance: 0.10 μF  Package: 0805  Voltage Rating: 25 V  [FP-C0805C-DN-IPC_B]  (hidden comment: C0805C104M3RACTU)
C47#2  Capacitance: 0.10 μF  Package: 0805  Voltage Rating: 25 V  [FP-C0805C-DN-IPC_B]  (hidden comment: C0805C104M3RACTU)
C48#2  Case/Package: 0805  Capacitance: 1uF  Voltage: 16V  [FP-CL21-IPC_A]  (hidden comment: CL21B105KOFNNNE)
C49#2  Case/Package: 0805  Voltage Rating (DC): 10V  Capacitance: 10uF  [FP-GRM21B-0_15-IPC_A]  (hidden comment: GRM21BR71A106KA73K)
C50#2  Capacitance: 0.10 μF  Package: 0805  Voltage Rating: 25 V  [FP-C0805C-DN-IPC_B]  (hidden comment: C0805C104M3RACTU)
C51  Case/Package: 0805  Capacitance: 1uF  Voltage: 16V  [FP-CL21-IPC_A]  (hidden comment: CL21B105KOFNNNE)
D17  DF2S10FS,L3M  [DIOM106X45N]
D18  DF2S10FS,L3M  [DIOM106X45N]
D19  DF2S10FS,L3M  [DIOM106X45N]
J24  0355070300
J25  4-103328-1  [TE_4-103328-1]
J26  QPC02SXGN-RC  [FP-QPC02SXGN-RC-MFG]
J27  QPC02SXGN-RC  [FP-QPC02SXGN-RC-MFG]
J28  4-103328-1  [TE_4-103328-1]
J29  4-103328-1  [TE_4-103328-1]
J30  QPC02SXGN-RC  [FP-QPC02SXGN-RC-MFG]
P1  35363-0360  [MOLX-35363-0360_V]
R43  Case Code (Imperial): 0805  Tolerance: 1%  Resistance: 100R  [FP-RMCF0805-IPC_A]  (hidden comment: RMCF0805FT100R)
R47  Case Code (Imperial): 0805  Tolerance: 1%  Resistance: 100R  [FP-RMCF0805-IPC_A]  (hidden comment: RMCF0805FT100R)
R89  Case/Package: 0805  Resistance: 0R  [FP-RMCF0805-MFG]  (hidden comment: RMCF0805ZT0R00)
R91  Case/Package: 0805  Resistance: 0R  [FP-RMCF0805-MFG]  (hidden comment: RMCF0805ZT0R00)
R92  Case/Package: 0805  Resistance: 0R  [FP-RMCF0805-MFG]  (hidden comment: RMCF0805ZT0R00)
R94  Case/Package: 0805  Resistance: 0R  [FP-RMCF0805-MFG]  (hidden comment: RMCF0805ZT0R00)
TP74  RCU-0C  [TP+195X110]  (value not drawn)
TP75  RCU-0C  [TP+195X110]  (value not drawn)
TP76  RCU-0C  [TP+195X110]  (value not drawn)
TP77  RCU-0C  [TP+195X110]  (value not drawn)
TP78  RCU-0C  [TP+195X110]  (value not drawn)
TP79  RCU-0C  [TP+195X110]  (value not drawn)
TP80  RCU-0C  [TP+195X110]  (value not drawn)
TP81  RCU-0C  [TP+195X110]  (value not drawn)
TP82  RCU-0C  [TP+195X110]  (value not drawn)
TP83  RCU-0C  [TP+195X110]  (value not drawn)
TP84  RCU-0C  [TP+195X110]  (value not drawn)
TP85  RCU-0C  [TP+195X110]  (value not drawn)
U20  MCP6411T-E/OT  [SOT95P280X145-5N]
U21  MCP3221A7T-E/OT  [SOT-23-OT5_M]

### Ports
AUDIO_OUT (out), I2C_SCL (bidir), I2C_SDA (in)

### Nets
GND: C46.1 C47#2.1 C48#2.2 C49#2.2 C50#2.2 C51.2 D17.2(A) D18.1(K) D18.2(A) D19.2(A) P1.2 R91.1 TP76.1 TP81.1 TP82.1 TP85.1 U20.2(VSS) U21.2(VSS)
PP3V3: R94.2
PP3V3_AUDIO: C46.2 C47#2.2 C49#2.1 C50#2.1 D19.1(K) P1.1 R94.1 TP74.1 TP75.1 TP83.1 U20.5(VDD) U21.1(VDD)
AUDIO_ADC_IN+: C51.1 R47.2 TP84.1 U21.3(AIN)
AUDIO_BUFF_IN+: J28.2 R89.1 R91.2 TP79.1 U20.3(VIN+)
AUDIO_BUFF_IN-: R92.1 U20.4(VIN-)
AUDIO_CONN: D17.1(K) P1.3 R89.2 TP80.1
AUDIO_OUT: C48#2.1 R43.2 TP77.1 ; port AUDIO_OUT
AUDIO_OUT_J: J25.2 J28.1 J29.2 R92.2 TP78.1 U20.1(VOUT)
AUDIO_OUT_R: J25.1 R43.1
I2C_SCL: U21.5(SCL) ; port I2C_SCL
I2C_SDA: U21.4(SDA) ; port I2C_SDA
NetJ29_1: J29.1 R47.1

### Notes on the sheet
- Audio Sensing
- Electret Microphone
- Electret Microphone Adafruit: https://www.adafruit.com/product/1063
- to internal 12bit ADC
- Buffer
- DNI
- (near TP83) 12bit ADC
- Isolate Audio Rail from 3V3 Rail
- Title
- Size:
- Date:
- B
- Number:
- Time:
- Revision:
- Sheet
- of
- File:
- (in symbol 0355070300) HOUSING
- (in symbol MCP6411T-E_OT) +; -

### Library data of the parts
C46 C47#2 C50#2 = CMP-2007-00282-2: as C36#2 on sheet VELOSTAT_SENSING; Digikey Description: CAP CER 0.1UF 25V 20% X7R 0805; Device Class L2: Capacitors; Temperature: -55°C to +125°C; Device Class L1: Passive Components; ComponentLink2Description: Datasheet; Mouser Description: Multilayer Ceramic Capacitors MLCC - SMD/SMT 25volts 0.1uF X7R 20%; Temperature Range High: +125°C; Device Class L3: Ceramic Capacitors; Automotive: No; Temperature Range Low: -55°C; RoHS: TRUE; Category: Cap; Lead Free: Yes; Ipc Land Pattern Name: CAPC200125X78; Height: 0.88mm; Temperature Characteristic: X7R; Octopart: https://octopart.com/c0805c104m3ractu-kemet-9138612; ComponentLink2URL: https://content.kemet.com/datasheets/KEM_C1003_C0G_SMD.pdf; Manufacturer Part Number: C0805C104M3RACTU; Supplier: Digi-Key; Supplier Part Number: 399-C0805C104M3RAC7800CT-ND
C48#2 C51 = CMP-13271-003098-1: as C50#1 on sheet VELOSTAT_SENSING; Width: 0.049inch; Thickness: 0.053inch; Voltage Rating: 16V; Max Operating Temperature: 125°C; Case Code (Imperial): 0805; Height: 1.25mm; Length: 2mm; Lead Free: Lead Free; Mount: Surface Mount; Tolerance: 10%; Voltage Rating (DC): 16V; Min Operating Temperature: -55°C; Contact Plating: Tin; Depth: 1.25mm; Packaging: Tape and Reel; Package Quantity: 1; Dielectric: X7R; Radiation Hardening: No; Case Code (Metric): 2012; Manufacturer Part Number: CL21B105KOFNNNE; Supplier: Digi-Key; Supplier Part Number: 1276-1026-1-ND
C49#2 = CMP-06035-038134-1: Chip Multilayer Ceramic Capacitors for General Purpose, 0805, 10uF, X7R, 15%, 10%, 10V; Manufacturer: Murata Electronics; Dielectric: X7R; Thickness: 1.25mm; Tolerance: 10%; Length: 2mm; Width: 1.25mm; Manufacturer Part Number: GRM21BR71A106KA73K; Supplier Part Number: 490-14381-1-ND; Supplier: Digi-Key
D17-D19 = DF2S10FS,L3M: TVS DIODE 8VWM FSC; Manufacturer_Name: Toshiba; Manufacturer: Toshiba Semiconductor and Storage; Datasheet Link: https://componentsearchengine.com/Datasheets/1/DF2S10FS,L3M.pdf; Height: 0.45mm; Manufacturer_Part_Number: DF2S10FS,L3M; Mouser Part Number: 757-DF2S10FSL3M; Mouser Price/Stock: https://www.mouser.co.uk/ProductDetail/Toshiba/DF2S10FSL3M?qs=lhkzy8lC%252BSsM5fAm2E7mCQ%3D%3D; Arrow Part Number: DF2S10FS,L3M; Arrow Price/Stock: https://www.arrow.com/en/products/df2s10fsl3m/toshiba?region=nac; Manufacturer Part Number: DF2S10FS,L3M; Supplier: Digi-Key; Supplier Part Number: DF2S10FSL3MCT-ND
J24 = 0355070300: Manufacturer: Molex; Manufacturer Part Number: 0355070300; Supplier: Digi-Key; Supplier Part Number: WM5982-ND
J25 J28 J29 = 4-103328-1: as J11#2 on sheet VELOSTAT_SENSING; SnapEDA_Link: https://www.snapeda.com/parts/4-103328-1/TE%20Connectivity%20AMP%20Connectors/view-part/2384420/?ref=snap; MP: 4-103328-1; TE_purchase_URL: https://www.te.com/usa-en/product-4-103328-1.html?te_bu=Cor&te_type=disp&te_campaign=seda_glo_cor-seda-global-disp-prtnr-fy19-seda-model-bom-cta_sma-317_1&elqCampaignId=32493; Availability: Unavailable; Value: *; EU_RoHS_Compliance: Compliant; Price: None; Package: None; Supplier: Digi-Key; Supplier Part Number: A121364-ND; Manufacturer Part Number: 4-103328-1
J26 J27 J30 = CMP-25666-000001-1: as J12#2 on sheet VELOSTAT_SENSING; Category: Conn; Temperature Range Low: -40°C; Temperature Range High: +85°C; Device Class L1: Connectors; Lead Free: Yes; Manufacturer Part Number: QPC02SXGN-RC; Automotive: No; Height: 6.17mm; ComponentLink2URL: https://s3.amazonaws.com/catalogspreads-pdf/PAGE128-129%20.100%20JUMPER.pdf; Device Class L2: unset; Footprint Url: https://drawings-pdf.s3.amazonaws.com/11510.pdf; Device Class L3: unset; Temperature: -40°C to +85°C; RoHS: TRUE; Digikey Description: CONN JUMPER SHORTING .100" GOLD; Octopart: https://octopart.com/qpc02sxgn-rc-sullins-19878795; Package: 0; ComponentLink2Description: Datasheet; Contact Material: Gold; Supplier: Digi-Key; Supplier Part Number: S9337-ND
P1 = CMP-2000-05595-1: Male Header, Pitch 2 mm, 1 x 3 Position, Height 5.5 mm, Tail Length 3.2 mm, -40 to 105 degC, RoHS, Bulk; Manufacturer: Molex; Manufacturer Part Number: 0353630360; Gender: HDR; Pitch: 2mm; Number of Contacts: 3; Datasheet Version: Rev. G, 01/2012; Package Description: Male Header, Pitch 2 mm, 1 x 3 Position, Height 5.5 mm, Tail Length 3.2 mm; Datasheet URL: http://www.molex.com/pdm_docs/sd/353630360_sd.pdf; Termination Method: Solder; Category: ConnectorHeadersandPCBReceptacles; Number of Rows: 1; Manufacturer URL: http://www.molex.com/; Type: WiretoBoard; Mounting Technology: ThroughHole; Package Reference: 35363-0360; Supplier: Digi-Key; Supplier Part Number: WM18932-ND
R43 R47 = CMP-26527-001731-1: 100Ω ±1% 0.125W 0805 Thick Film Chip Resistor AEC-Q200 compliant; Manufacturer: Stackpole Electronics Inc; Power Rating: 250mW; Temperature Coefficient: 100ppm/°C; Max Power Dissipation: 125mW; Radiation Hardening: No; RoHS Compliant: Yes; Depth: 1.25mm; Length: 2mm; Min Operating Temperature: -55°C; Series: RMCF; Packaging: Tape and Reel; Features: Automotive AEC-Q200; Height: 0.026inch; Size Code: 0805; Number of Terminations: 2; Max Operating Temperature: 155°C; Case/Package: 0805; Width: 0.049inch; Contact Plating: Tin; Resistor Type: Thick Film; Construction: Rectangular; Lead Free: Lead Free; Military Standard: Not; Case Code (Metric): 2012; Mount: Surface Mount; Manufacturer Part Number: RMCF0805FT100R; Supplier: Digi-Key; Supplier Part Number: RMCF0805FT100RCT-ND
R89 R91 R92 R94 = CMP-26527-000017-1: as R57#2 on sheet VELOSTAT_SENSING; Depth: 1.25mm; Length: 2mm; Military Standard: Not; Width: 0.049inch; Case Code (Imperial): 0805; Number of Terminations: 2; Mount: Surface Mount; Contact Plating: Tin; Height: 0.026inch; Min Operating Temperature: -55°C; Composition: Thick Film; Max Operating Temperature: 155°C; Packaging: Tape and Reel; Features: Automotive AEC-Q200; Max Power Dissipation: 125mW; Radiation Hardening: No; Lead Free: Lead Free; Case Code (Metric): 2012; Supplier: Digi-Key; Supplier Part Number: RMCF0805ZT0R00CT-ND; Manufacturer Part Number: RMCF0805ZT0R00
TP74-TP85 = RCU-0C: as TP158-TP174 on sheet VELOSTAT_SENSING; Value: *; Package: SON-6 TE Connectivity AMP Connectors; Purchase-URL: https://pricing.snapeda.com/search/part/RCU-0C/?ref=eda; Supplier Part Number: A106145CT-ND; Check_prices: https://www.snapeda.com/parts/RCU-0C/TE%20Connectivity/view-part/4791537/?ref=eda; Manufacturer Part Number: RCU-0C; SnapEDA_Link: https://www.snapeda.com/parts/RCU-0C/TE%20Connectivity/view-part/4791537/?ref=snap; Supplier: Digi-Key
U20 = MCP6411T-E_OT: as U18 on sheet VELOSTAT_SENSING; Datasheet Link: http://ww1.microchip.com/downloads/en/DeviceDoc/20005791B.pdf; Height: 1.45mm; Manufacturer Part Number: MCP6411T-E/OT; Mouser Part Number: 579-MCP6411T-E/OT; Mouser Price/Stock: https://www.mouser.com/Search/Refine.aspx?Keyword=579-MCP6411T-E%2FOT; Arrow Part Number: MCP6411T-E/OT; Arrow Price/Stock: https://www.arrow.com/en/products/mcp6411t-eot/microchip-technology; Supplier: Digi-Key; Supplier Part Number: MCP6411T-E/OTCT-ND
U21 = MCP3221A7T-E/OT: Low Power 12-Bit A/D Converter With I2C Interface, 5-Pin SOT-23, Extended Temperature, Tape and Reel; Manufacturer: Microchip Technology; ComponentLink1Description: Manufacturer URL; ComponentLink2URL: http://ww1.microchip.com/downloads/en/DeviceDoc/21732c.pdf; RevisionNote: URLs added.; ComponentLink3URL: http://www.microchip.com/stellent/groups/techpub_sg/documents/packagingspec/en012702.pdf; Code_IPC: SOT23-5; ComponentLink3Description: Package Specification; ComponentLink1URL: http://www.microchip.com/; PackageVersion: revBB, Aug-2009; PackageReference: SOT-23-OT5; ComponentLink2Description: Datasheet; DatasheetVersion: revC, Jul-2006; PackageDescription: 5-Lead Plastic Small Outline Transistor (OT) [SOT-23]; Manufacturer Part Number: MCP3221A7T-E/OT; Supplier: Digi-Key; Supplier Part Number: MCP3221A7T-E/OTCT-ND

## Nets that join several sheets
GND: POWER_MCU (40 pins), SD_CARD_WiFi (26 pins), POWER_MUXES (21 pins), SENSE_MUXES (27 pins), VELOSTAT_SENSING (18 pins), MAT_CABLING_CONNECTOR (15 pins), MICROPHONE (18 pins)
PP3V3: POWER_MCU (29 pins), SD_CARD_WiFi (13 pins), POWER_MUXES (18 pins), SENSE_MUXES (24 pins), VELOSTAT_SENSING (C47#1.2 R60#2.2 U18.5), MICROPHONE (R94.2)
3V3_SENSE: POWER_MCU (U2.17), POWER_MUXES (C26.1 R54.2 TP26.1)
AUDIO_OUT: POWER_MCU (U2.10), MICROPHONE (C48#2.1 R43.2 TP77.1)
BTN_TEST: POWER_MCU (U2.37), SD_CARD_WiFi (C20.1 R36.2)
GPIO_RGB_B: POWER_MCU (U2.38), SD_CARD_WiFi (R48.1)
GPIO_RGB_G: POWER_MCU (U2.39), SD_CARD_WiFi (R44.1)
GPIO_RGB_R: POWER_MCU (U2.40), SD_CARD_WiFi (R41.1)
I2C_SCL: POWER_MCU (R67#1.2 U2.62), SD_CARD_WiFi (J10.2), MICROPHONE (U21.5)
I2C_SDA: POWER_MCU (R66#1.2 U2.61), SD_CARD_WiFi (J10.1), MICROPHONE (U21.4)
PWR_MUX1_EN_L: POWER_MCU (U2.26), POWER_MUXES (R57#1.1 TP31.1 U6.6)
PWR_MUX1_Y0: POWER_MUXES (U6.13), MAT_CABLING_CONNECTOR (D5.5 J21.1)
PWR_MUX1_Y1: POWER_MUXES (U6.14), MAT_CABLING_CONNECTOR (D5.6 J21.2)
PWR_MUX1_Y2: POWER_MUXES (U6.15), MAT_CABLING_CONNECTOR (D5.4 J21.3)
PWR_MUX1_Y3: POWER_MUXES (U6.12), MAT_CABLING_CONNECTOR (D5.7 J21.4)
PWR_MUX1_Y4: POWER_MUXES (U6.1), MAT_CABLING_CONNECTOR (D5.8 J21.5)
PWR_MUX1_Y5: POWER_MUXES (U6.5), MAT_CABLING_CONNECTOR (D5.2 J21.6)
PWR_MUX1_Y6: POWER_MUXES (U6.2), MAT_CABLING_CONNECTOR (D5.9 J21.7)
PWR_MUX1_Y7: POWER_MUXES (U6.4), MAT_CABLING_CONNECTOR (D5.1 J21.8)
PWR_MUX2_EN_L: POWER_MCU (U2.25), POWER_MUXES (R56.1 TP30.1 U5.6)
PWR_MUX2_Y0: POWER_MUXES (U5.13), MAT_CABLING_CONNECTOR (D6.5 J21.9)
PWR_MUX2_Y1: POWER_MUXES (U5.14), MAT_CABLING_CONNECTOR (D6.6 J21.10)
PWR_MUX2_Y2: POWER_MUXES (U5.15), MAT_CABLING_CONNECTOR (D6.4 J21.11)
PWR_MUX2_Y3: POWER_MUXES (U5.12), MAT_CABLING_CONNECTOR (D6.7 J21.12)
PWR_MUX2_Y4: POWER_MUXES (U5.1), MAT_CABLING_CONNECTOR (D6.8 J21.13)
PWR_MUX2_Y5: POWER_MUXES (U5.5), MAT_CABLING_CONNECTOR (D6.2 J21.14)
PWR_MUX2_Y6: POWER_MUXES (U5.2), MAT_CABLING_CONNECTOR (D6.9 J21.15)
PWR_MUX2_Y7: POWER_MUXES (U5.4), MAT_CABLING_CONNECTOR (D6.1 J21.16)
PWR_MUX3_EN_L: POWER_MCU (U2.24), POWER_MUXES (R61.1 TP32.1 U7.6)
PWR_MUX3_Y0: POWER_MUXES (U7.13), MAT_CABLING_CONNECTOR (D7.5 J21.17)
PWR_MUX3_Y1: POWER_MUXES (U7.14), MAT_CABLING_CONNECTOR (D7.6 J21.18)
PWR_MUX3_Y2: POWER_MUXES (U7.15), MAT_CABLING_CONNECTOR (D7.4 J21.19)
PWR_MUX3_Y3: POWER_MUXES (U7.12), MAT_CABLING_CONNECTOR (D7.7 J21.20)
PWR_MUX3_Y4: POWER_MUXES (U7.1), MAT_CABLING_CONNECTOR (D7.8 J21.21)
PWR_MUX3_Y5: POWER_MUXES (U7.5), MAT_CABLING_CONNECTOR (D7.2 J21.22)
PWR_MUX3_Y6: POWER_MUXES (U7.2), MAT_CABLING_CONNECTOR (D7.9 J21.23)
PWR_MUX3_Y7: POWER_MUXES (U7.4), MAT_CABLING_CONNECTOR (D7.1 J21.24)
PWR_MUX4_EN_L: POWER_MCU (U2.23), POWER_MUXES (R62.1 TP33.1 U8.6)
PWR_MUX4_Y0: POWER_MUXES (U8.13), MAT_CABLING_CONNECTOR (D8.5 J21.25)
PWR_MUX4_Y1: POWER_MUXES (U8.14), MAT_CABLING_CONNECTOR (D8.6 J21.26)
PWR_MUX4_Y2: POWER_MUXES (U8.15), MAT_CABLING_CONNECTOR (D8.4 J21.27)
PWR_MUX4_Y3: POWER_MUXES (U8.12), MAT_CABLING_CONNECTOR (D8.7 J21.28)
PWR_MUX4_Y4: POWER_MUXES (U8.1), MAT_CABLING_CONNECTOR (D8.8 J21.29)
PWR_MUX4_Y5: POWER_MUXES (U8.5), MAT_CABLING_CONNECTOR (D8.2 J21.30)
PWR_MUX4_Y6: POWER_MUXES (U8.2), MAT_CABLING_CONNECTOR (D8.9 J21.31)
PWR_MUX4_Y7: POWER_MUXES (U8.4), MAT_CABLING_CONNECTOR (D8.1 J21.32)
PWR_MUX_IN: POWER_MCU (U2.8), POWER_MUXES (R51.1 U3.4)
PWR_MUX_S1: POWER_MCU (U2.20), POWER_MUXES (6 pins)
PWR_MUX_S2: POWER_MCU (U2.21), POWER_MUXES (6 pins)
PWR_MUX_S3: POWER_MCU (U2.22), POWER_MUXES (6 pins)
SD_CS_L: POWER_MCU (U2.58), SD_CARD_WiFi (R28.1 SD1.2)
SENSE_MUX1_EN_L: POWER_MCU (U2.11), SENSE_MUXES (R63.1 TP37.1 U9.6)
SENSE_MUX1_Y0: SENSE_MUXES (U9.13), MAT_CABLING_CONNECTOR (D9.5 J21.34)
SENSE_MUX1_Y1: SENSE_MUXES (U9.14), MAT_CABLING_CONNECTOR (D9.6 J21.35)
SENSE_MUX1_Y2: SENSE_MUXES (U9.15), MAT_CABLING_CONNECTOR (D9.4 J21.36)
SENSE_MUX1_Y3: SENSE_MUXES (U9.12), MAT_CABLING_CONNECTOR (D9.7 J21.37)
SENSE_MUX1_Y4: SENSE_MUXES (U9.1), MAT_CABLING_CONNECTOR (D9.8 J21.38)
SENSE_MUX1_Y5: SENSE_MUXES (U9.5), MAT_CABLING_CONNECTOR (D9.2 J21.39)
SENSE_MUX1_Y6: SENSE_MUXES (U9.2), MAT_CABLING_CONNECTOR (D9.9 J21.40)
SENSE_MUX1_Y7: SENSE_MUXES (U9.4), MAT_CABLING_CONNECTOR (D9.1 J21.41)
SENSE_MUX2_EN_L: POWER_MCU (U2.9), SENSE_MUXES (R64.1 TP38.1 U10.6)
SENSE_MUX2_Y0: SENSE_MUXES (U10.13), MAT_CABLING_CONNECTOR (D10.5 J21.42)
SENSE_MUX2_Y1: SENSE_MUXES (U10.14), MAT_CABLING_CONNECTOR (D10.6 J21.43)
SENSE_MUX2_Y2: SENSE_MUXES (U10.15), MAT_CABLING_CONNECTOR (D10.4 J21.44)
SENSE_MUX2_Y3: SENSE_MUXES (U10.12), MAT_CABLING_CONNECTOR (D10.7 J21.45)
SENSE_MUX2_Y4: SENSE_MUXES (U10.1), MAT_CABLING_CONNECTOR (D10.8 J21.46)
SENSE_MUX2_Y5: SENSE_MUXES (U10.5), MAT_CABLING_CONNECTOR (D10.2 J21.47)
SENSE_MUX2_Y6: SENSE_MUXES (U10.2), MAT_CABLING_CONNECTOR (D10.9 J21.48)
SENSE_MUX2_Y7: SENSE_MUXES (U10.4), MAT_CABLING_CONNECTOR (D10.1 J21.49)
SENSE_MUX3_EN_L: POWER_MCU (U2.29), SENSE_MUXES (R68.1 TP42.1 U11.6)
SENSE_MUX3_Y0: SENSE_MUXES (U11.13), MAT_CABLING_CONNECTOR (D11.5 J21.51)
SENSE_MUX3_Y1: SENSE_MUXES (U11.14), MAT_CABLING_CONNECTOR (D11.4 J21.52)
SENSE_MUX3_Y2: SENSE_MUXES (U11.15), MAT_CABLING_CONNECTOR (D11.6 J21.53)
SENSE_MUX3_Y3: SENSE_MUXES (U11.12), MAT_CABLING_CONNECTOR (D11.7 J21.54)
SENSE_MUX3_Y4: SENSE_MUXES (U11.1), MAT_CABLING_CONNECTOR (D11.8 J21.55)
SENSE_MUX3_Y5: SENSE_MUXES (U11.5), MAT_CABLING_CONNECTOR (D11.2 J21.56)
SENSE_MUX3_Y6: SENSE_MUXES (U11.2), MAT_CABLING_CONNECTOR (D11.9 J21.57)
SENSE_MUX3_Y7: SENSE_MUXES (U11.4), MAT_CABLING_CONNECTOR (D11.1 J21.58)
SENSE_MUX4_EN_L: POWER_MCU (U2.30), SENSE_MUXES (R69.1 TP43.1 U12.6)
SENSE_MUX4_Y0: SENSE_MUXES (U12.13), MAT_CABLING_CONNECTOR (D12.1 J21.59)
SENSE_MUX4_Y1: SENSE_MUXES (U12.14), MAT_CABLING_CONNECTOR (D12.9 J21.60)
SENSE_MUX4_Y2: SENSE_MUXES (U12.15), MAT_CABLING_CONNECTOR (D12.2 J21.61)
SENSE_MUX4_Y3: SENSE_MUXES (U12.12), MAT_CABLING_CONNECTOR (D12.8 J21.62)
SENSE_MUX4_Y4: SENSE_MUXES (U12.1), MAT_CABLING_CONNECTOR (D12.7 J21.63)
SENSE_MUX4_Y5: SENSE_MUXES (U12.5), MAT_CABLING_CONNECTOR (D12.4 J21.64)
SENSE_MUX4_Y6: SENSE_MUXES (U12.2), MAT_CABLING_CONNECTOR (D12.6 J21.65)
SENSE_MUX4_Y7: SENSE_MUXES (U12.4), MAT_CABLING_CONNECTOR (D12.5 J21.66)
SENSE_MUX5_EN_L: POWER_MCU (U2.33), SENSE_MUXES (R70.1 TP46.1 U13.6)
SENSE_MUX5_Y0: SENSE_MUXES (U13.13), MAT_CABLING_CONNECTOR (D13.1 J21.67)
SENSE_MUX5_Y1: SENSE_MUXES (U13.14), MAT_CABLING_CONNECTOR (D13.9 J21.68)
SENSE_MUX5_Y2: SENSE_MUXES (U13.15), MAT_CABLING_CONNECTOR (D13.2 J21.69)
SENSE_MUX5_Y3: SENSE_MUXES (U13.12), MAT_CABLING_CONNECTOR (D13.8 J21.70)
SENSE_MUX5_Y4: SENSE_MUXES (U13.1), MAT_CABLING_CONNECTOR (D13.7 J21.71)
SENSE_MUX5_Y5: SENSE_MUXES (U13.5), MAT_CABLING_CONNECTOR (D13.4 J21.72)
SENSE_MUX5_Y6: SENSE_MUXES (U13.2), MAT_CABLING_CONNECTOR (D13.6 J21.73)
SENSE_MUX5_Y7: SENSE_MUXES (U13.4), MAT_CABLING_CONNECTOR (D13.5 J21.74)
SENSE_MUX6_EN_L: POWER_MCU (U2.2), SENSE_MUXES (R71.1 TP47.1 U14.6)
SENSE_MUX6_Y0: SENSE_MUXES (U14.13), MAT_CABLING_CONNECTOR (D14.1 J21.75)
SENSE_MUX6_Y1: SENSE_MUXES (U14.14), MAT_CABLING_CONNECTOR (D14.9 J21.76)
SENSE_MUX6_Y2: SENSE_MUXES (U14.15), MAT_CABLING_CONNECTOR (D14.2 J21.77)
SENSE_MUX6_Y3: SENSE_MUXES (U14.12), MAT_CABLING_CONNECTOR (D14.8 J21.78)
SENSE_MUX6_Y4: SENSE_MUXES (U14.1), MAT_CABLING_CONNECTOR (D14.7 J21.79)
SENSE_MUX6_Y5: SENSE_MUXES (U14.5), MAT_CABLING_CONNECTOR (D14.4 J21.80)
SENSE_MUX6_Y6: SENSE_MUXES (U14.2), MAT_CABLING_CONNECTOR (D14.6 J21.81)
SENSE_MUX6_Y7: SENSE_MUXES (U14.4), MAT_CABLING_CONNECTOR (D14.5 J21.82)
SENSE_MUX7_EN_L: POWER_MCU (U2.3), SENSE_MUXES (R72.1 TP50.1 U15.6)
SENSE_MUX7_Y0: SENSE_MUXES (U15.13), MAT_CABLING_CONNECTOR (D15.1 J21.83)
SENSE_MUX7_Y1: SENSE_MUXES (U15.14), MAT_CABLING_CONNECTOR (D15.9 J21.84)
SENSE_MUX7_Y2: SENSE_MUXES (U15.15), MAT_CABLING_CONNECTOR (D15.2 J21.85)
SENSE_MUX7_Y3: SENSE_MUXES (U15.12), MAT_CABLING_CONNECTOR (D15.8 J21.86)
SENSE_MUX7_Y4: SENSE_MUXES (U15.1), MAT_CABLING_CONNECTOR (D15.7 J21.87)
SENSE_MUX7_Y5: SENSE_MUXES (U15.5), MAT_CABLING_CONNECTOR (D15.4 J21.88)
SENSE_MUX7_Y6: SENSE_MUXES (U15.2), MAT_CABLING_CONNECTOR (D15.6 J21.89)
SENSE_MUX7_Y7: SENSE_MUXES (U15.4), MAT_CABLING_CONNECTOR (D15.5 J21.90)
SENSE_MUX8_EN_L: POWER_MCU (U2.4), SENSE_MUXES (R73.1 TP51.1 U16.6)
SENSE_MUX8_Y0: SENSE_MUXES (U16.13), MAT_CABLING_CONNECTOR (D16.1 J21.91)
SENSE_MUX8_Y1: SENSE_MUXES (U16.14), MAT_CABLING_CONNECTOR (D16.9 J21.92)
SENSE_MUX8_Y2: SENSE_MUXES (U16.15), MAT_CABLING_CONNECTOR (D16.2 J21.93)
SENSE_MUX8_Y3: SENSE_MUXES (U16.12), MAT_CABLING_CONNECTOR (D16.8 J21.94)
SENSE_MUX8_Y4: SENSE_MUXES (U16.1), MAT_CABLING_CONNECTOR (D16.7 J21.95)
SENSE_MUX8_Y5: SENSE_MUXES (U16.5), MAT_CABLING_CONNECTOR (D16.4 J21.96)
SENSE_MUX8_Y6: SENSE_MUXES (U16.2), MAT_CABLING_CONNECTOR (D16.6 J21.97)
SENSE_MUX8_Y7: SENSE_MUXES (U16.4), MAT_CABLING_CONNECTOR (D16.5 J21.98)
SENSE_MUX_OUT: SENSE_MUXES (9 pins), VELOSTAT_SENSING (J11#2.2 J17.2 TP159.1)
SENSE_MUX_S1: POWER_MCU (U2.14), SENSE_MUXES (10 pins)
SENSE_MUX_S2: POWER_MCU (U2.15), SENSE_MUXES (10 pins)
SENSE_MUX_S3: POWER_MCU (U2.16), SENSE_MUXES (10 pins)
SENSE_OUT: POWER_MCU (U2.27), VELOSTAT_SENSING (C38#2.1 R105.2 TP165.1)
SPI_CS2_L: POWER_MCU (U2.57), SD_CARD_WiFi (J11#1.1 R45.2)
SPI_MISO: POWER_MCU (U2.35), SD_CARD_WiFi (J12#1.1 R30.1 SD1.7)
SPI_MOSI: POWER_MCU (U2.36), SD_CARD_WiFi (J12#1.2 R29.1 SD1.3)
SPI_SCK: POWER_MCU (U2.34), SD_CARD_WiFi (J9.2 SD1.5)
UART_RX: POWER_MCU (U2.51), SD_CARD_WiFi (R35.1)
UART_TX: POWER_MCU (U2.52), SD_CARD_WiFi (R33.1)
WIFI_EN: POWER_MCU (U2.53), SD_CARD_WiFi (D3.7 J6.3 R31.2 TP21.1)
WIFI_RST: POWER_MCU (U2.54), SD_CARD_WiFi (D3.8 J6.5 R32.2 TP20.1)